# Altium project 28Pins V01.PrjPcb (part 1 of 3)
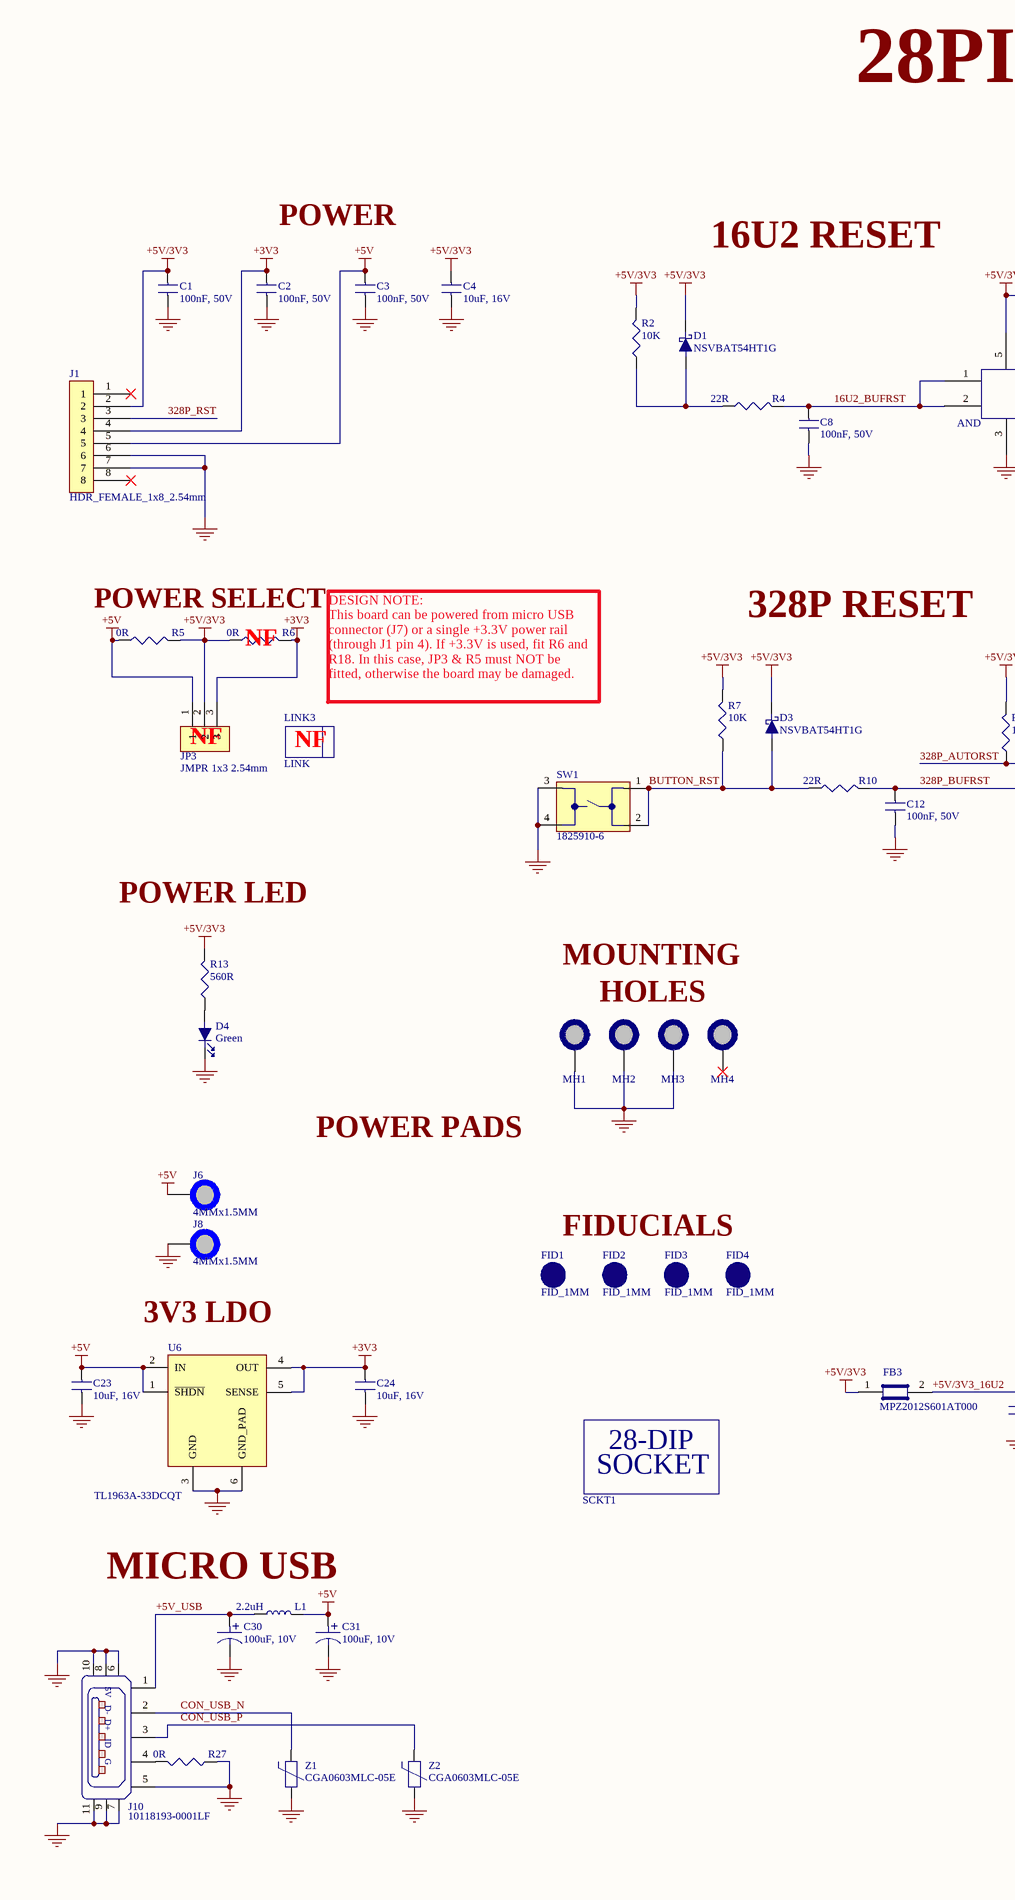
[diagram p0: 28Pins Schematic.SchDoc, left]
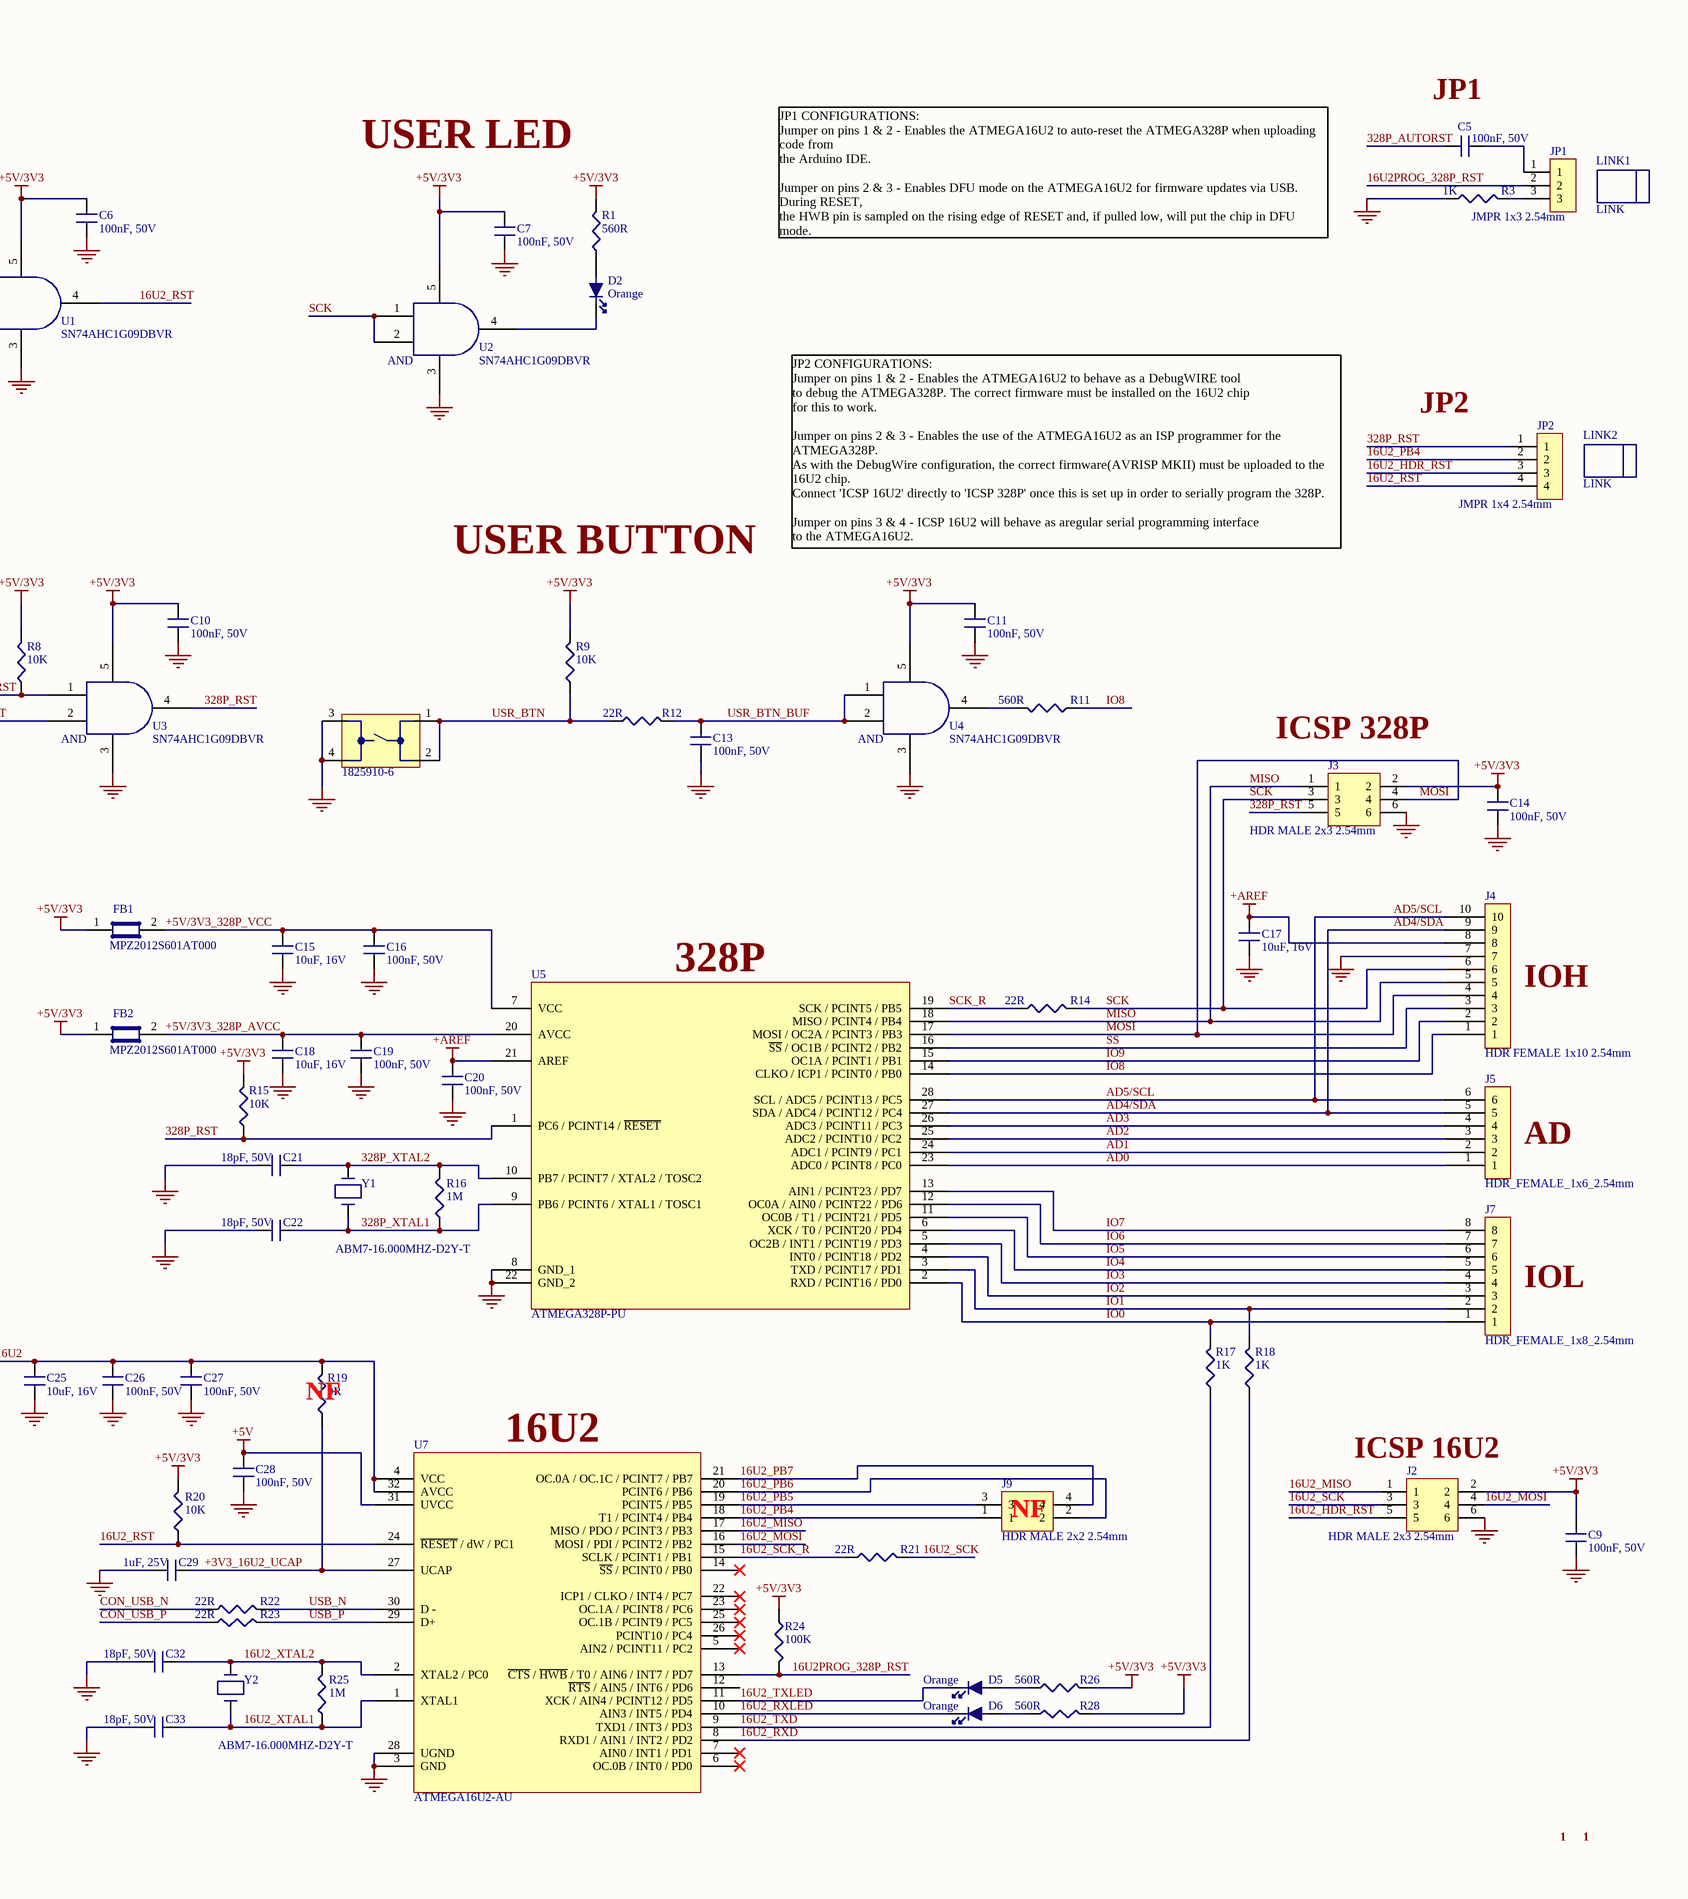
[diagram p1: 28Pins Schematic.SchDoc, right]
Company: James Morar; Project: 28 Pins Project; Title: 28Pins; VersionRevision: V01
1 sheet, 109 parts. Net scope: global (net labels, ports and power ports of the same name join across sheets).
Board file: 28Pins PCB V01.PcbDoc

## Sheet 28Pins Schematic.SchDoc: 28Pins
size A2; Author: James Morar; DocumentNumber: 3; SheetNumber: 3; SheetTotal: 5; Version: V01

### Parts
C1  100nF, 50V  [C0805]
C2  100nF, 50V  [C0805]
C3  100nF, 50V  [C0805]
C4  10uF, 16V  [C0805_1.25MM_HEIGHT]
C5  100nF, 50V  [C0805]
C6  100nF, 50V  [C0805]
C7  100nF, 50V  [C0805]
C8  100nF, 50V  [C0805]
C9  100nF, 50V  [C0805]
C10  100nF, 50V  [C0805]
C11  100nF, 50V  [C0805]
C12  100nF, 50V  [C0805]
C13  100nF, 50V  [C0805]
C14  100nF, 50V  [C0805]
C15  10uF, 16V  [C0805_1.25MM_HEIGHT]
C16  100nF, 50V  [C0805]
C17  10uF, 16V  [C0805_1.25MM_HEIGHT]
C18  10uF, 16V  [C0805_1.25MM_HEIGHT]
C19  100nF, 50V  [C0805]
C20  100nF, 50V  [C0805]
C21  18pF, 50V  [C0805]
C22  18pF, 50V  [C0805]
C23  10uF, 16V  [C0805_1.25MM_HEIGHT]
C24  10uF, 16V  [C0805_1.25MM_HEIGHT]
C25  10uF, 16V  [C0805_1.25MM_HEIGHT]
C26  100nF, 50V  [C0805]
C27  100nF, 50V  [C0805]
C28  100nF, 50V  [C0805]
C29  1uF, 25V  [C0805]
C30  100uF, 10V  [C_ALU_C_SIZE]
C31  100uF, 10V  [C_ALU_C_SIZE]
C32  18pF, 50V  [C0805]
C33  18pF, 50V  [C0805]
D1  NSVBAT54HT1G  [D_ BAT54HT1G]
D2  Orange  [LED_0603_Orange]
D3  NSVBAT54HT1G  [D_ BAT54HT1G]
D4  Green  [LED_0603_GREEN]
D5  Orange  [LED_0603_Orange]
D6  Orange  [LED_0603_Orange]
FB1  MPZ2012S601AT000  [C0805]
FB2  MPZ2012S601AT000  [C0805]
FB3  MPZ2012S601AT000  [C0805]
FID1  FID_1MM  [FID_40X120D]  (no BOM)
FID2  FID_1MM  [FID_40X120D]  (no BOM)
FID3  FID_1MM  [FID_40X120D]  (no BOM)
FID4  FID_1MM  [FID_40X120D]  (no BOM)
J1  HDR_FEMALE_1x8_2.54mm  [HDR_FEMALE_1x8_2.54mm]
J2  HDR MALE 2x3 2.54mm  [HDR_MALE_2x3_2.54MM]
J3  HDR MALE 2x3 2.54mm  [HDR_MALE_2x3_2.54MM]
J4  HDR FEMALE 1x10 2.54mm
J5  HDR_FEMALE_1x6_2.54mm  [HDR_FEMALE_1x6_2.54mm]
J6  4MMx1.5MM  [PAD_WITH_HOLE_4MMx1.5MM]  (no BOM)
J7  HDR_FEMALE_1x8_2.54mm  [HDR_FEMALE_1x8_2.54mm]
J8  4MMx1.5MM  [PAD_WITH_HOLE_4MMx1.5MM]  (no BOM)
J9  HDR MALE 2x2 2.54mm  [HDR_MALE_2x2_2.54MM]
J10  10118193-0001LF  [10118193-0001LF]
JP1  JMPR 1x3 2.54mm  [JMPR_1x3_2.54MM]
JP2  JMPR 1x4 2.54mm  [JMPR_1x4_2.54mm]
JP3  JMPR 1x3 2.54mm  [JMPR_1x3_2.54MM]
L1  2.2uH  [C1210_IND]
LINK1  LINK  (mechanical)
LINK2  LINK  (mechanical)
LINK3  LINK  (mechanical)
MH1  MH_7.4MMC_3.2MMD  [MH_7.4MMH_3.2MMD]  (value not drawn)  (no BOM)
MH2  MH_7.4MMC_3.2MMD  [MH_7.4MMH_3.2MMD]  (value not drawn)  (no BOM)
MH3  MH_7.4MMC_3.2MMD  [MH_7.4MMH_3.2MMD]  (value not drawn)  (no BOM)
MH4  MH_7.4MMNC_3.2MMD  [MH_7.4MMNC_3.2MMD]  (value not drawn)  (no BOM)
R1  560R  [R0805]
R2  10K
R3  1K  [R0805]
R4  22R  [R0805]
R5  0R  [R0805]
R6  0R  [R0805]
R7  10K
R8  10K
R9  10K
R10  22R  [R0805]
R11  560R  [R0805]
R12  22R  [R0805]
R13  560R  [R0805]
R14  22R  [R0805]
R15  10K
R16  1M  [R0805]
R17  1K  [R0805]
R18  1K  [R0805]
R19  0R  [R0805]
R20  10K
R21  22R  [R0805]
R22  22R  [R0805]
R23  22R  [R0805]
R24  100K  [R0805]
R25  1M  [R0805]
R26  560R  [R0805]
R27  0R  [R0805]
R28  560R  [R0805]
SCKT1  28-DIP Socket  [28-DIP_SCKT_2.54MM]  (value not drawn)
SW1  1825910-6  [1825910-6]
SW2  1825910-6  [1825910-6]
U1  SN74AHC1G09DBVR  [DBV_SOT23_5]
U2  SN74AHC1G09DBVR  [DBV_SOT23_5]
U3  SN74AHC1G09DBVR  [DBV_SOT23_5]
U4  SN74AHC1G09DBVR  [DBV_SOT23_5]
U5  ATMEGA328P-PU  [28_DIP_7.62mm]
U6  TL1963A-33DCQT  [TL1963A-33DCQT]
U7  ATMEGA16U2-AU  [TQFP32]
Y1  ABM7-16.000MHZ-D2Y-T  [ABM7_16MHZ_XTAL_SMD]
Y2  ABM7-16.000MHZ-D2Y-T  [ABM7_16MHZ_XTAL_SMD]
Z1  CGA0603MLC-05E  [R0603]
Z2  CGA0603MLC-05E  [R0603]

### Nets
+3V3: C2.2 C24.2 J1.4 JP3.3 R6.2 U6.4(OUT) U6.5(SENSE)
+5V: C3.2 C23.2 C28.2 C31.1 J1.5 J6.1 JP3.1 L1.2 R5.1 U6.1(~{SHDN}) U6.2(IN) U7.31(UVCC)
+5V/3V3: C1.2 C4.2 C6.2 C7.2 C9.2 C10.2 C11.2 C14.2 D1.2(K) D3.2(K) FB1.1 FB2.1 FB3.1 J1.2 J2.2 J3.2 JP3.2 R1.2 R2.2 R5.2 R6.1 R7.2 R8.2 R9.2 R13.2 R15.2 R20.2 R24.1 R26.2 R28.2 U1.5 U2.5 U3.5 U4.5
+AREF: C17.2 C20.2 J4.8 U5.21(AREF)
GND: C1.1 C2.1 C3.1 C4.1 C6.1 C7.1 C8.1 C9.1 C10.1 C11.1 C12.1 C13.1 C14.1 C15.1 C16.1 C17.1 C18.1 C19.1 C20.1 C21.1 C22.1 C23.1 C24.1 C25.1 C26.1 C27.1 C28.1 C29.2 C30.2 C31.2 C32.1 C33.1 D4.2(K) J1.6 J1.7 J2.6 J3.6 J4.7 J8.1 J10.5 J10.6 J10.7 J10.8 J10.9 J10.10 J10.11 MH1.1 MH2.1 MH3.1 R3.1 R27.1 SW1.3 SW1.4 SW2.3 SW2.4 U1.3 U2.3 U3.3 U4.3 U5.8(GND_1) U5.22(GND_2) U6.3(GND) U6.6(GND_PAD) U7.3(GND) U7.28(UGND) Z1.1 Z2.1
16U2_BUFRST: C8.2 R4.2 U1.1 U1.2
16U2_HDR_RST: J2.5 JP2.3
16U2_MISO: J2.1 U7.17(MISO_/_PDO_/_PCINT3_/_PB3)
16U2_MOSI: J2.4 U7.16(MOSI_/_PDI_/_PCINT2_/_PB2)
16U2_PB4: J9.1 JP2.2 U7.18(T1_/_PCINT4_/_PB4)
16U2_PB5: J9.3 U7.19(PCINT5_/_PB5)
16U2_PB6: J9.2 U7.20(PCINT6_/_PB6)
16U2_PB7: J9.4 U7.21(OC.0A_/_OC.1C_/_PCINT7_/_PB7)
16U2_RST: JP2.4 R20.1 U1.4 U7.24(~{RESET}_/_dW_/_PC1)
16U2_RXD: R18.1 U7.8(RXD1_/_AIN1_/_INT2_/_PD2)
16U2_RXLED: D6.2(K) U7.10(AIN3_/_INT5_/_PD4)
16U2_SCK: J2.3 R21.2
16U2_SCK_R: R21.1 U7.15(SCLK_/_PCINT1_/_PB1)
16U2_TXD: R17.1 U7.9(TXD1_/_INT3_/_PD3)
16U2_TXLED: D5.2(K) U7.11(XCK_/_AIN4_/_PCINT12_/_PD5)
16U2_XTAL1: C33.2 R25.1 U7.1(XTAL1) Y2.1
16U2_XTAL2: C32.2 R25.2 U7.2(XTAL2_/_PC0) Y2.2
16U2PROG_328P_RST: JP1.2 R24.2 U7.13(~{CTS}_/_~{HWB}_/_T0_/_AIN6_/_INT7_/_PD7)
328P_AUTORST: C5.2 R8.1 U3.1
328P_BUFRST: C12.2 R10.2 U3.2
328P_RST: J1.3 J3.5 JP2.1 R15.1 U3.4 U5.1(PC6_/_PCINT14_/_~{RESET})
328P_XTAL1: C22.2 R16.1 U5.9(PB6_/_PCINT6_/_XTAL1_/_TOSC1) Y1.1
328P_XTAL2: C21.2 R16.2 U5.10(PB7_/_PCINT7_/_XTAL2_/_TOSC2) Y1.2
+3V3_16U2_UCAP: C29.1 R19.1 U7.27(UCAP)
+5V/3V3_16U2: C25.2 C26.2 C27.2 FB3.2 R19.2 U7.4(VCC) U7.32(AVCC)
+5V/3V3_328P_AVCC: C18.2 C19.2 FB2.2 U5.20(AVCC)
+5V/3V3_328P_VCC: C15.2 C16.2 FB1.2 U5.7(VCC)
+5V_USB: C30.1 J10.1 L1.1
AD0: J5.1 U5.23(ADC0_/_PCINT8_/_PC0)
AD1: J5.2 U5.24(ADC1_/_PCINT9_/_PC1)
AD2: J5.3 U5.25(ADC2_/_PCINT10_/_PC2)
AD3: J5.4 U5.26(ADC3_/_PCINT11_/_PC3)
AD4/SDA: J4.9 J5.5 U5.27(SDA_/_ADC4_/_PCINT12_/_PC4)
AD5/SCL: J4.10 J5.6 U5.28(SCL_/_ADC5_/_PCINT13_/_PC5)
BUTTON_RST: D3.1(A) R7.1 R10.1 SW1.1 SW1.2
CON_USB_N: J10.2 R22.1 Z1.2
CON_USB_P: J10.3 R23.1 Z2.2
IO0: J7.1 R17.2 U5.2(RXD_/_PCINT16_/_PD0)
IO1: J7.2 R18.2 U5.3(TXD_/_PCINT17_/_PD1)
IO2: J7.3 U5.4(INT0_/_PCINT18_/_PD2)
IO3: J7.4 U5.5(OC2B_/_INT1_/_PCINT19_/_PD3)
IO4: J7.5 U5.6(XCK_/_T0_/_PCINT20_/_PD4)
IO5: J7.6 U5.11(OC0B_/_T1_/_PCINT21_/_PD5)
IO6: J7.7 U5.12(OC0A_/_AIN0_/_PCINT22_/_PD6)
IO7: J7.8 U5.13(AIN1_/_PCINT23_/_PD7)
IO8: J4.1 R11.1 U5.14(CLKO_/_ICP1_/_PCINT0_/_PB0)
IO9: J4.2 U5.15(OC1A_/_PCINT1_/_PB1)
MISO: J3.1 J4.5 U5.18(MISO_/_PCINT4_/_PB4)
MOSI: J3.4 J4.4 U5.17(MOSI_/_OC2A_/_PCINT3_/_PB3)
SCK: J3.3 J4.6 R14.2 U2.1 U2.2
SCK_R: R14.1 U5.19(SCK_/_PCINT5_/_PB5)
SS: J4.3 U5.16(~{SS}_/_OC1B_/_PCINT2_/_PB2)
USB_N: R22.2 U7.30(D_-)
USB_P: R23.2 U7.29(D+)
USR_BTN: R9.1 R12.1 SW2.1 SW2.2
USR_BTN_BUF: C13.2 R12.2 U4.1 U4.2
NetC5_1: C5.1 JP1.1
NetD1_1: D1.1(A) R2.1 R4.1
NetD2_1: D2.1(A) R1.1
NetD2_2: D2.2(K) U2.4
NetD4_1: D4.1(A) R13.1
NetD5_1: D5.1(A) R26.1
NetD6_1: D6.1(A) R28.1
NetJ10_4: J10.4 R27.2
NetJP1_3: JP1.3 R3.2
NetR11_2: R11.2 U4.4

Not connected (* = marked no-connect by the designer): J1 1* 8*; MH4 1*; U7 5(AIN2_/_PCINT11_/_PC2)* 6(OC.0B_/_INT0_/_PD0)* 7(AIN0_/_INT1_/_PD1)* 12(~{RTS}_/_AIN5_/_INT6_/_PD6) 14(~{SS}_/_PCINT0_/_PB0)* 22(ICP1_/_CLKO_/_INT4_/_PC7)* 23(OC.1A_/_PCINT8_/_PC6)* 25(OC.1B_/_PCINT9_/_PC5)* 26(PCINT10_/_PC4)*

### Notes on the sheet
- 28PINS BOARD
- POWER
- 16U2 RESET
- USER LED
- (near C5) JP1
- JP1 CONFIGURATIONS:
  Jumper on pins 1 & 2 - Enables the ATMEGA16U2 to auto-reset the ATMEGA328P when uploading code from
  the Arduino IDE.
  Jumper on pins 2 & 3 - Enables DFU mode on the ATMEGA16U2 for firmware updates via USB. During RESET,
  the HWB pin is sampled on the rising edge of RESET and, if pulled low, will put the chip in DFU mode.
- JP2
- POWER SELECT
- 328P RESET
- JP2 CONFIGURATIONS:
  Jumper on pins 1 & 2 - Enables the ATMEGA16U2 to behave as a DebugWIRE tool
  to debug the ATMEGA328P. The correct firmware must be installed on the 16U2 chip
  for this to work.
  Jumper on pins 2 & 3 - Enables the use of the ATMEGA16U2 as an ISP programmer for the ATMEGA328P.
  As with the DebugWire configuration, the correct firmware(AVRISP MKII) must be uploaded to the 16U2 chip.
  Connect 'ICSP 16U2' directly to 'ICSP 328P' once this is set up in order to serially program the 328P.
  Jumper on pins 3 & 4 - ICSP 16U2 will behave as aregular serial programming interface
  to the ATMEGA16U2.
- (near R6) NF
- USER BUTTON
- (near JP3) NF
- (near LINK3) NF
- DESIGN NOTE:
  This board can be powered from micro USB
  connector (J7) or a single +3.3V power rail
  (through J1 pin 4). If +3.3V is used, fit R6 and
  R18. In this case, JP3 & R5 must NOT be
  fitted, otherwise the board may be damaged.
- (near J3) ICSP 328P
- POWER LED
- MOUNTING
- HOLES
- (near U5) 328P
- (near J4) IOH
- POWER PADS
- FIDUCIALS
- (near J5) AD
- 3V3 LDO
- (near J7) IOL
- (near R19) NF
- (near U7) 16U2
- (near J2) ICSP 16U2
- (near J9) NF
- MICRO USB
- 1
- (in symbol 4828-3004-CP) 28-DIP; SOCKET
- (in symbol 10118193-0001LF) 5V; D-; D+; ID; G
- (in symbol SN74AHC1G09DBVR) AND